# Altium schematic sheet NesCat.SchDoc
size A
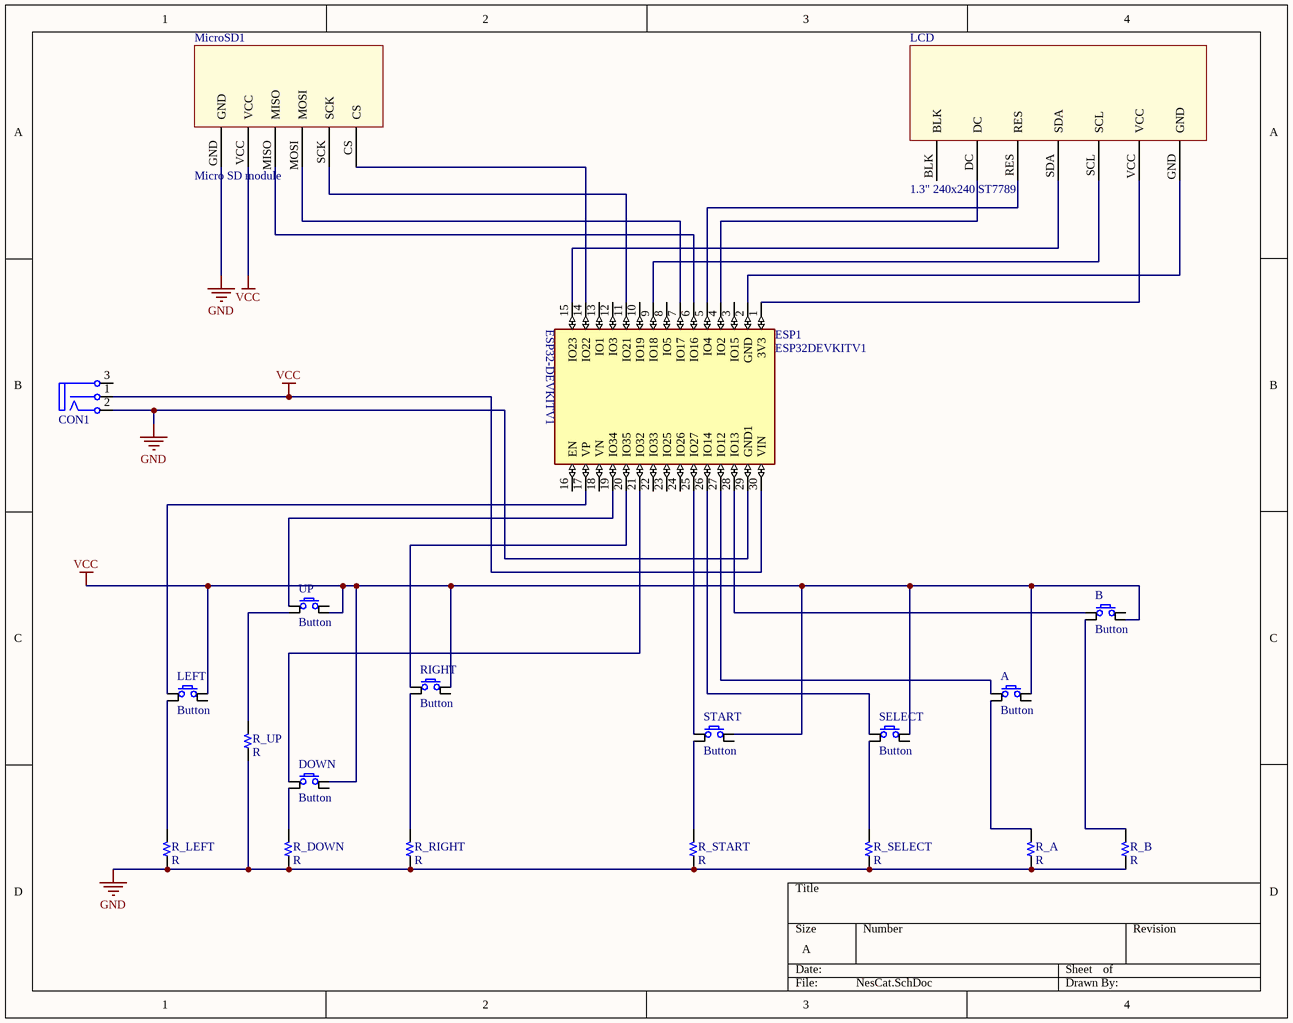
[diagram p0: NesCat.SchDoc]

## Parts
A  Button  [SW/4/12mm]
B  Button  [SW/4/12mm]
CON1  CON DC PWR  [CONN/DC/PWR/5.0MM]  (value not drawn)
DOWN  Button  [SW/4/12mm]
ESP1  ESP32DEVKITV1  [ESP32-DEVKITV1_3D]
LCD  1.3" 240x240 ST7789  [1.3" 240x240 ST7789]
LEFT  Button  [SW/4/12mm]
MicroSD1  Micro SD module  [PCBComponent_1]
R_A  R  [R 1/4W/300]
R_B  R  [R 1/4W/300]
R_DOWN  R  [R 1/4W/300]
R_LEFT  R  [R 1/4W/300]
R_RIGHT  R  [R 1/4W/300]
R_SELECT  R  [R 1/4W/300]
R_START  R  [R 1/4W/300]
R_UP  R  [R 1/4W/300]
RIGHT  Button  [SW/4/12mm]
SELECT  Button  [SW/4/12mm]
START  Button  [SW/4/12mm]
UP  Button  [SW/4/12mm]

## Nets
GND: CON1.2(T) ESP1.29(GND1) MicroSD1.GND R_A.1 R_B.1 R_DOWN.1 R_LEFT.1 R_RIGHT.1 R_SELECT.1 R_START.1 R_UP.1
VCC: A.3 B.4 CON1.1(S) DOWN.3 ESP1.30(VIN) LEFT.3 MicroSD1.VCC RIGHT.3 SELECT.3 START.3 UP.4
NetA_1: A.1 ESP1.27(IO12)
NetA_2: A.2 R_A.2
NetB_1: B.1 ESP1.28(IO13)
NetB_2: B.2 R_B.2
NetDOWN_1: DOWN.1 ESP1.21(IO32)
NetDOWN_2: DOWN.2 R_DOWN.2
NetESP1_1: ESP1.1(3V3) LCD.VCC
NetESP1_2: ESP1.2(GND) LCD.GND
NetESP1_4: ESP1.4(IO2) LCD.DC
NetESP1_5: ESP1.5(IO4) LCD.RES
NetESP1_6: ESP1.6(IO16) MicroSD1.MISO
NetESP1_7: ESP1.7(IO17) MicroSD1.MOSI
NetESP1_9: ESP1.9(IO18) LCD.SCL
NetESP1_11: ESP1.11(IO21) MicroSD1.SCK
NetESP1_14: ESP1.14(IO22) MicroSD1.CS
NetESP1_15: ESP1.15(IO23) LCD.SDA
NetESP1_17: ESP1.17(VP) LEFT.1
NetESP1_19: ESP1.19(IO34) UP.1
NetESP1_20: ESP1.20(IO35) RIGHT.1
NetESP1_25: ESP1.25(IO27) START.1
NetESP1_26: ESP1.26(IO14) SELECT.1
NetLEFT_2: LEFT.2 R_LEFT.2
NetR_RIGHT_2: R_RIGHT.2 RIGHT.2
NetR_SELECT_2: R_SELECT.2 SELECT.2
NetR_START_2: R_START.2 START.2
NetR_UP_2: R_UP.2 UP.2

Not connected (* = marked no-connect by the designer): A 4; B 3; CON1 3(TN); DOWN 4; ESP1 3(IO15) 8(IO5) 10(IO19) 12(IO3) 13(IO1) 16(EN) 18(VN) 22(IO33) 23(IO25) 24(IO26); LCD BLK; LEFT 4; RIGHT 4; SELECT 4; START 4; UP 3

## Notes on the sheet
- (in symbol ESP32DEVKITV1) ESP32-DEVKITV1

## Library data of the parts
A B DOWN LEFT RIGHT SELECT START UP = SW SPST 4-pin: Tact switch 4-pin
CON1 = CON DC PWR: DC input connector
ESP1 = ESP32DEVKITV1: Dual core, Wi-Fi: 2.4 GHz up to 150 Mbits/s,BLE (Bluetooth Low Energy) and legacy Bluetooth, 32 bits, Up to 240 MHz; MF: Do it; Check_prices: https://www.snapeda.com/parts/ESP32%20DEVKIT%20V1/Do%20it/view-part/5659245/?ref=eda; Value: *; SnapEDA_Link: https://www.snapeda.com/parts/ESP32%20DEVKIT%20V1/Do%20it/view-part/5659245/?ref=snap; Package: Package; Availability: Unavailable; Price: None; MP: ESP32 DEVKIT V1
R_A R_B R_DOWN R_LEFT R_RIGHT R_SELECT R_START R_UP = Resistor